# EAGLE schematic fretscanner2 (EAGLE 6.6.0)
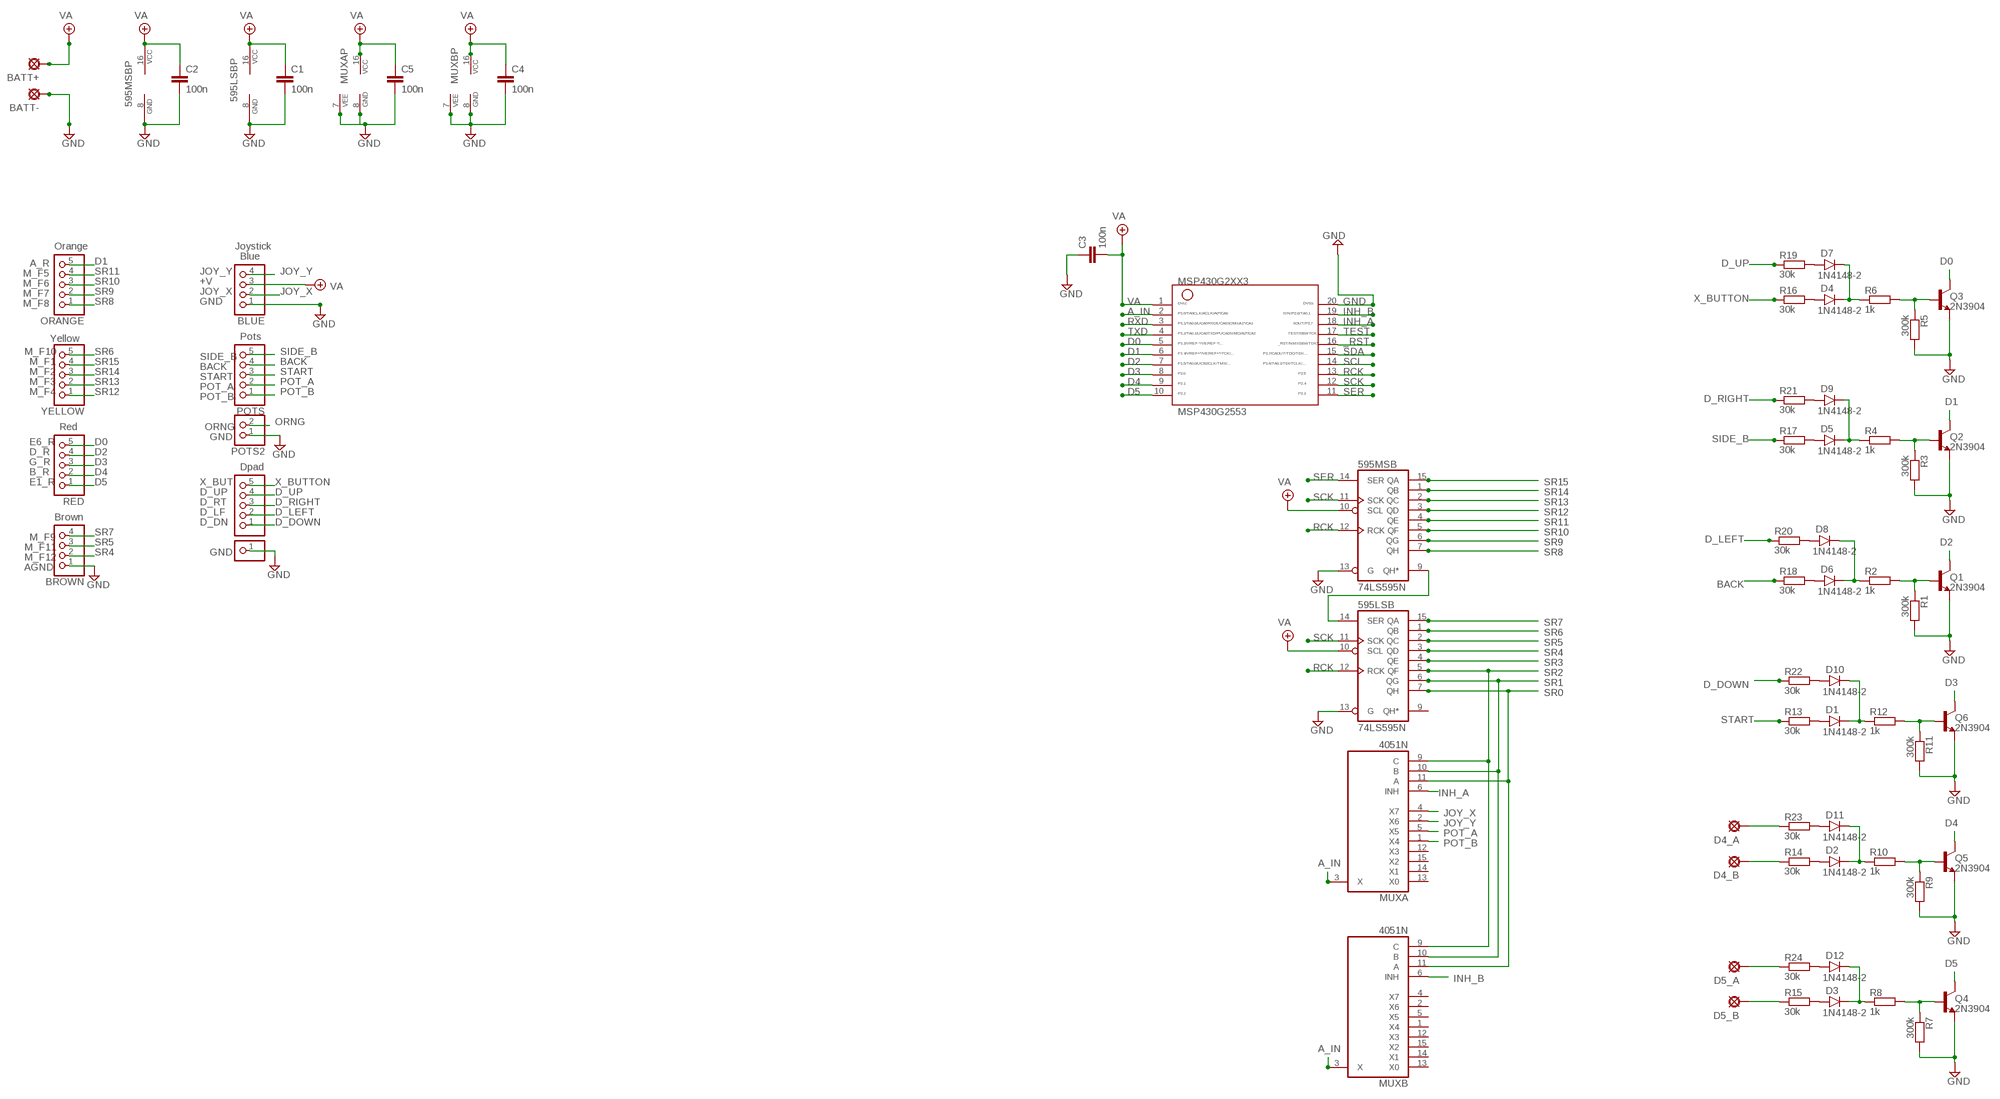
[diagram p0: schematic, sheet 1]

## Parts
595LSB  74LS595N  [DIL16]
595MSB  74LS595N  [DIL16]
BATT+  PADL  [LONG]
BATT-  PADL  [LONG]
BLUE  PINHD-1X4  [1X04]
BROWN  PINHD-1X4  [1X04]
C1  100n  050X030_050  [050X030_050_3]
C2  100n  050X030_050  [050X030_050_3]
C3  100n  050X030_050  [050X030_050_3]
C4  100n  050X030_050  [050X030_050_3]
C5  100n  050X030_050  [050X030_050_3]
D1  1N4148-2  [DO35-2]
D2  1N4148-2  [DO35-2]
D3  1N4148-2  [DO35-2]
D4  1N4148-2  [DO35-2]
D4_A  PAD  [SQUARE]
D4_B  PAD  [SQUARE]
D5  1N4148-2  [DO35-2]
D5_A  PAD  [SQUARE]
D5_B  PAD  [SQUARE]
D6  1N4148-2  [DO35-2]
D7  1N4148-2  [DO35-2]
D8  1N4148-2  [DO35-2]
D9  1N4148-2  [DO35-2]
D10  1N4148-2  [DO35-2]
D11  1N4148-2  [DO35-2]
D12  1N4148-2  [DO35-2]
DPAD  PINHD-1X5  [1X05]
DPAD2  PINHD-1X1  [1X01]
MSP430G2553  G2XX3---N20  [N20]
MUXA  4051N  [DIL16]
MUXB  4051N  [DIL16]
ORANGE  PINHD-1X5  [1X05]
POTS  PINHD-1X5  [1X05]
POTS2  PINHD-1X2  [1X02]
Q1  2N3904  [TO92-]
Q2  2N3904  [TO92-]
Q3  2N3904  [TO92-]
Q4  2N3904  [TO92-]
Q5  2N3904  [TO92-]
Q6  2N3904  [TO92-]
R1  300k  6MM-EU1  [R0207/1V]
R2  1k  6MM-EU  [R0207/3]
R3  300k  6MM-EU1  [R0207/1V]
R4  1k  6MM-EU  [R0207/3]
R5  300k  6MM-EU1  [R0207/1V]
R6  1k  6MM-EU  [R0207/3]
R7  300k  6MM-EU1  [R0207/1V]
R8  1k  6MM-EU  [R0207/3]
R9  300k  6MM-EU1  [R0207/1V]
R10  1k  6MM-EU  [R0207/3]
R11  300k  6MM-EU1  [R0207/1V]
R12  1k  6MM-EU  [R0207/3]
R13  30k  6MM-EU  [R0207/3]
R14  30k  6MM-EU  [R0207/3]
R15  30k  6MM-EU  [R0207/3]
R16  30k  6MM-EU  [R0207/3]
R17  30k  6MM-EU  [R0207/3]
R18  30k  6MM-EU  [R0207/3]
R19  30k  6MM-EU  [R0207/3]
R20  30k  6MM-EU  [R0207/3]
R21  30k  6MM-EU  [R0207/3]
R22  30k  6MM-EU  [R0207/3]
R23  30k  6MM-EU  [R0207/3]
R24  30k  6MM-EU  [R0207/3]
RED  PINHD-1X5  [1X05]
YELLOW  PINHD-1X5  [1X05]

## Nets
_RST: MSP430G2553.16
A_IN: MSP430G2553.2 MUXA.3(X) MUXB.3(X)
BACK: POTS.4 R18.1
D0: MSP430G2553.5 Q3.1(C) RED.5
D1: MSP430G2553.6 ORANGE.5 Q2.1(C)
D2: MSP430G2553.7 Q1.1(C) RED.4
D3: MSP430G2553.8 Q6.1(C) RED.3
D4: MSP430G2553.9 Q5.1(C) RED.2
D5: MSP430G2553.10 Q4.1(C) RED.1
D_DOWN: DPAD.1 R22.1
D_LEFT: DPAD.2 R20.1
D_RIGHT: DPAD.3 R21.1
D_UP: DPAD.4 R19.1
GND: 595LSB.8(GND) 595LSB.13(G) 595MSB.8(GND) 595MSB.13(G) BATT-.1(PAD) BLUE.1 BROWN.1 C1.2 C2.2 C3.1 C4.2 C5.2 DPAD2.1 MSP430G2553.20 MUXA.7(VEE) MUXA.8(GND) MUXB.7(VEE) MUXB.8(GND) POTS2.1 Q1.3(E) Q2.3(E) Q3.3(E) Q4.3(E) Q5.3(E) Q6.3(E) R1.2 R3.2 R5.2 R7.2 R9.2 R11.2
INH_A: MSP430G2553.18 MUXA.6(INH)
INH_B: MSP430G2553.19 MUXB.6(INH)
JOY_X: BLUE.2 MUXA.4(X7)
JOY_Y: BLUE.4 MUXA.2(X6)
N$1: 595LSB.14(SER) 595MSB.9(QH*)
N$2: Q2.2(B) R3.1 R4.2
N$3: D3.A R15.2
N$4: D5.C D9.C R4.1
N$5: Q3.2(B) R5.1 R6.2
N$6: Q1.2(B) R1.1 R2.2
N$7: D6.C D8.C R2.1
N$8: D4.A R16.2
N$9: D5.A R17.2
N$10: D4.C D7.C R6.1
N$11: Q4.2(B) R7.1 R8.2
N$12: D6.A R18.2
N$13: D3.C D12.C R8.1
N$14: Q5.2(B) R9.1 R10.2
N$15: D1.A R13.2
N$17: D2.C D11.C R10.1
N$18: Q6.2(B) R11.1 R12.2
N$19: D2.A R14.2
N$20: D1.C D10.C R12.1
N$21: D7.A R19.2
N$22: D8.A R20.2
N$23: D9.A R21.2
N$24: D10.A R22.2
N$25: D4_B.1(PAD) R14.1
N$26: D5_B.1(PAD) R15.1
N$27: D11.A R23.2
N$29: D12.A R24.2
N$30: D4_A.1(PAD) R23.1
N$31: D5_A.1(PAD) R24.1
ORNG: POTS2.2
POT_A: MUXA.5(X5) POTS.2
POT_B: MUXA.1(X4) POTS.1
RCK: 595LSB.12(RCK) 595MSB.12(RCK) MSP430G2553.13
RXD: MSP430G2553.3
SCK: 595LSB.11(SCK) 595MSB.11(SCK) MSP430G2553.12
SCL: MSP430G2553.14
SDA: MSP430G2553.15
SER: 595MSB.14(SER) MSP430G2553.11
SIDE_B: POTS.5 R17.1
SR0: 595LSB.7(QH) MUXA.11(A) MUXB.11(A)
SR1: 595LSB.6(QG) MUXA.10(B) MUXB.10(B)
SR2: 595LSB.5(QF) MUXA.9(C) MUXB.9(C)
SR3: 595LSB.4(QE)
SR4: 595LSB.3(QD) BROWN.2
SR5: 595LSB.2(QC) BROWN.3
SR6: 595LSB.1(QB) YELLOW.5
SR7: 595LSB.15(QA) BROWN.4
SR8: 595MSB.7(QH) ORANGE.1
SR9: 595MSB.6(QG) ORANGE.2
SR10: 595MSB.5(QF) ORANGE.3
SR11: 595MSB.4(QE) ORANGE.4
SR12: 595MSB.3(QD) YELLOW.1
SR13: 595MSB.2(QC) YELLOW.2
SR14: 595MSB.1(QB) YELLOW.3
SR15: 595MSB.15(QA) YELLOW.4
START: POTS.3 R13.1
TEST: MSP430G2553.17
TXD: MSP430G2553.4
VA: 595LSB.10(SCL) 595LSB.16(VCC) 595MSB.10(SCL) 595MSB.16(VCC) BATT+.1(PAD) BLUE.3 C1.1 C2.1 C3.2 C4.1 C5.1 MSP430G2553.1 MUXA.16(VCC) MUXB.16(VCC)
X_BUTTON: DPAD.5 R16.1
Unconnected: 595LSB.9(QH*) MUXA.12(X3) MUXA.13(X0) MUXA.14(X1) MUXA.15(X2) MUXB.1(X4) MUXB.2(X6) MUXB.4(X7) MUXB.5(X5) MUXB.12(X3) MUXB.13(X0) MUXB.14(X1) MUXB.15(X2)

## Notes on the sheet
- Orange | Joystick
- A_R | Blue
- M_F5
- JOY_Y
- M_F6
- +V
- M_F7
- JOY_X
- M_F8
- GND
- Yellow
- Pots
- M_F10
- SIDE_B
- M_F1
- BACK
- M_F2
- START
- M_F3
- POT_A
- M_F4
- POT_B
- Red | ORNG
- GND
- E6_R
- D_R
- G_R
- Dpad
- B_R
- E1_R | X_BUT
- D_UP
- D_RT
- D_LF
- Brown
- D_DN
- M_F9
- M_F11
- GND
- M_F12
- AGND

## Library data of the parts
595LSB 595MSB = 74xx-us:74*595: 8-bit SHIFT REGISTER, output latch
BATT+ BATT- D4_A D4_B D5_A D5_B = gm-supply:PAD: PAD use this package for pads with any purpose, including input, output, send or return various pad shapes: round, square, octogonal, long, and long offset
BLUE BROWN = pinhead:PINHD-1X4: PIN HEADER
C1-C5 = gm-caps-ceramic:050X030_050: 120 - 150pF Xicon Ceramic Disc 5mm lead spacing
D1-D12 = gm-diodes:1N4148: Fast Switching Diode DO-35 glass case a.k.a. 1N914
DPAD ORANGE POTS RED YELLOW = pinhead:PINHD-1X5: PIN HEADER
DPAD2 = pinhead:PINHD-1X1: PIN HEADER
MSP430G2553 = TI_MSP430_v16:G2XX3---N20: MSP430G2XX1 PDIP (N) 20 Pin Package
MUXA MUXB = 40xx:4051: 8-channel ANALOG MULTIPLEXER
POTS2 = pinhead:PINHD-1X2: PIN HEADER
Q1-Q6 = gm-trans:2N3904: NPN Transistor
R1-R24 = gm-resistors:6MM-EU: 6mm Resistors (European schematic symbol) Leads spaced 1-6 holes apart for 0.1" perfboard. Suitable for 1/4 watt resistors.